# EAGLE design SWD-ud-a-01 (EAGLE 9.5.0)
Assembly variants: 20161007, 20161128
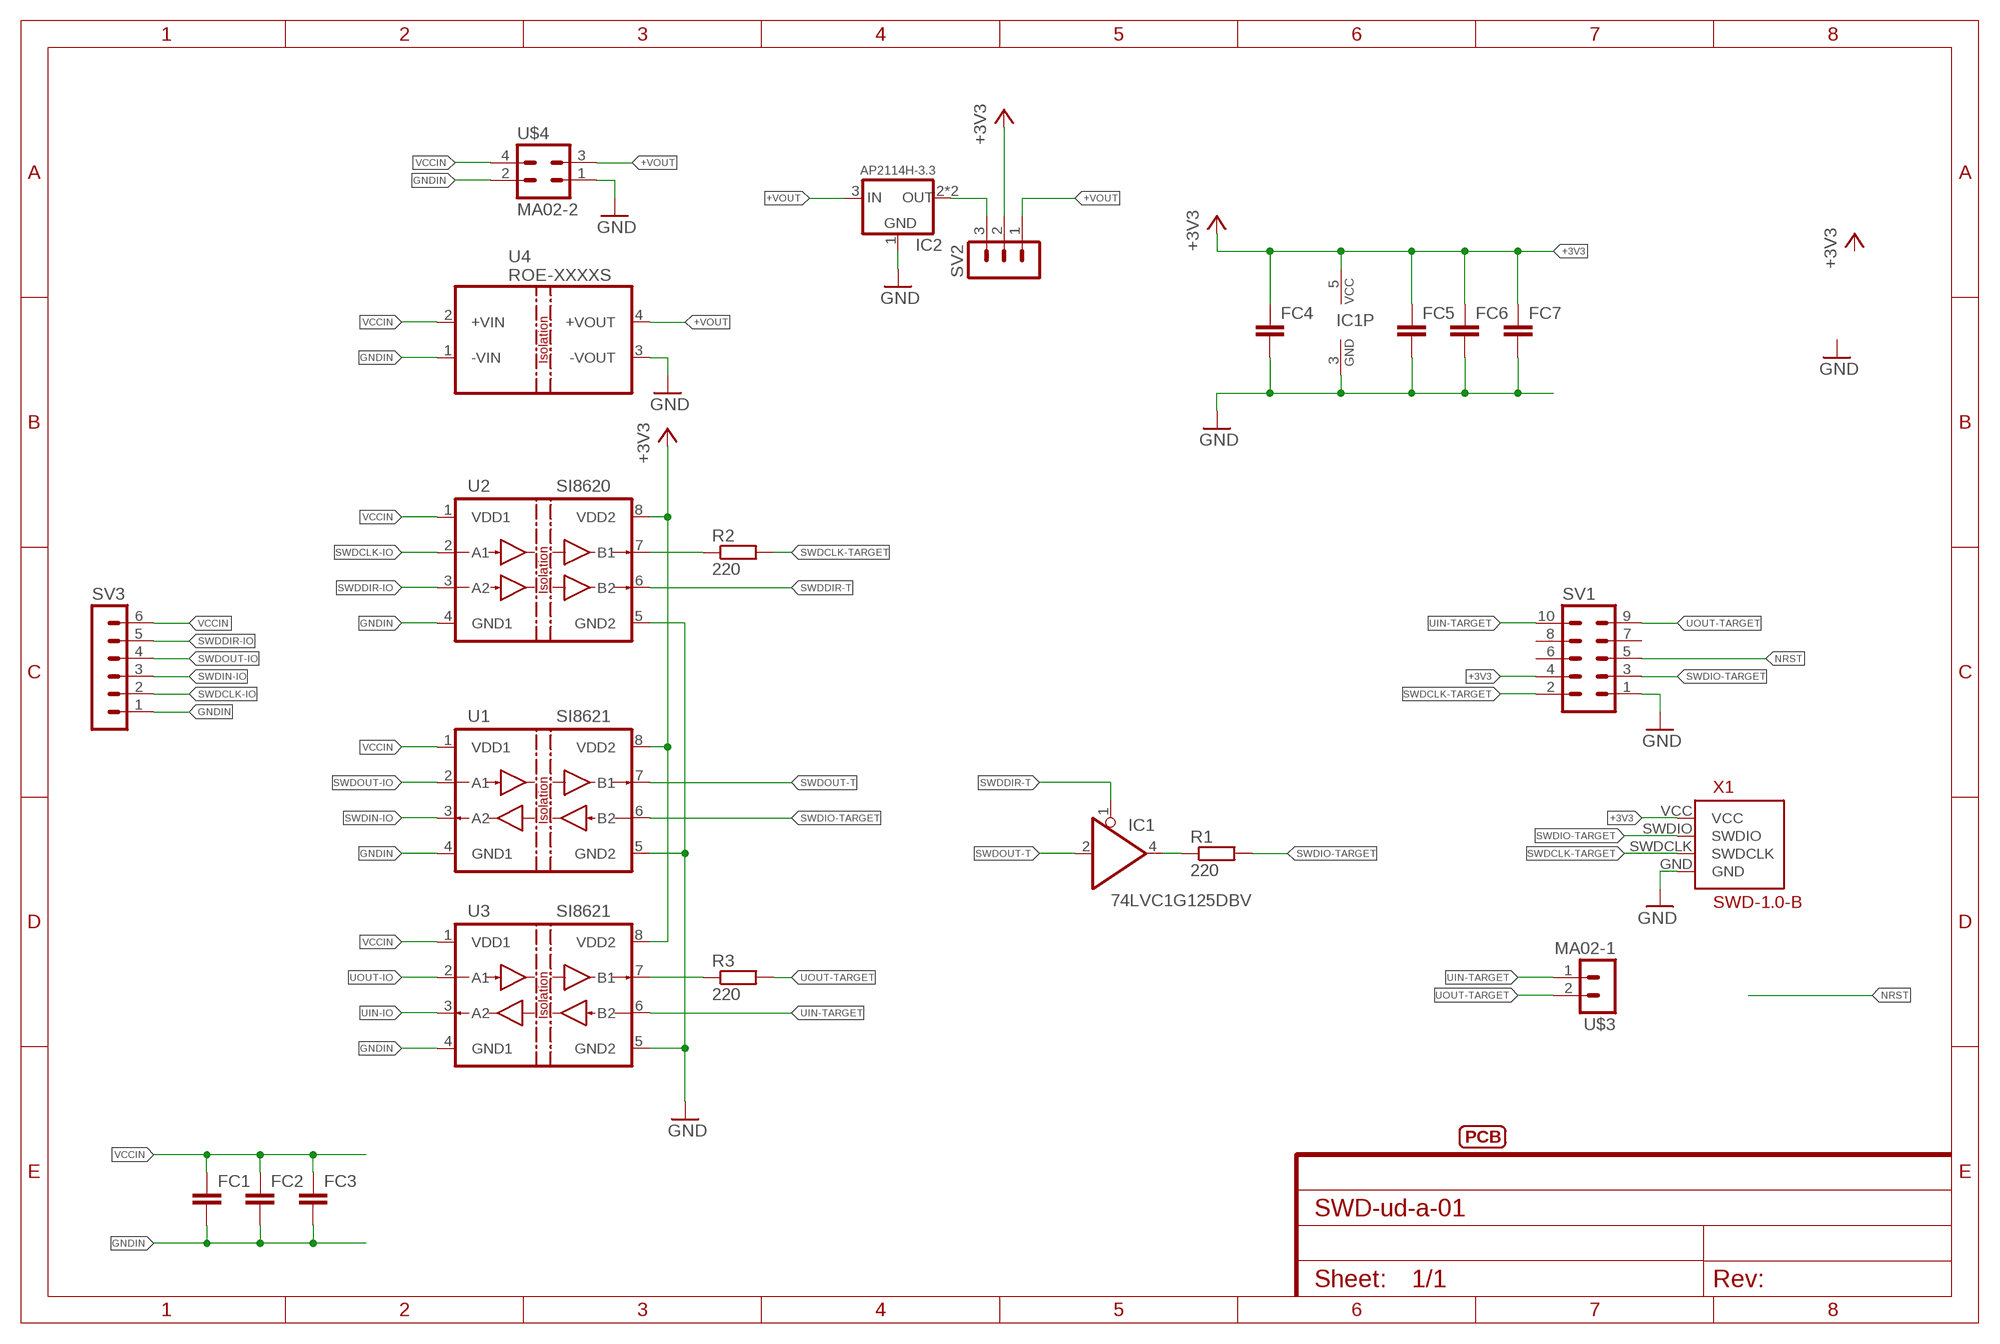
[diagram p0: schematic, sheet 1]

## Parts
FC1  C-EUC0805  [C0805]
FC2  C-EUC0805  [C0805]
FC3  C-EUC0805  [C0805]
FC4  C-EUC0805  [C0805]
FC5  C-EUC0805  [C0805]
FC6  C-EUC0805  [C0805]
FC7  C-EUC0805  [C0805]
IC1  74LVC1G125DBV  [SOT23-5]
IC2  AP2114H-3.3  AP2114H  [SOT223]
R1  220  R-EU_R0603  [R0603]
R2  220  R-EU_R0603  [R0603]
R3  220  R-EU_R0603  [R0603]
SV1  MA05-2  [MA05-2]
SV2  MA03-1  [MA03-1]
SV3  MA06-1  [MA06-1]
U1  SI8621  SI8421  [SOIC-8]
U2  SI8620  [SOIC-8]
U3  SI8621  SI8421  [SOIC-8]
U4  ROE-XXXXS  [ROE-SIP-4]
U$2  ENCLOSURE-CN-60X54  [ENCLOSURE-CN-60X54]
U$3  MA02-1  [MA02-1]
U$4  MA02-2  [MA02-2]
X1  SWD-1.0-B  [SWD-1.0-B]

## Nets
+3V3 [power]: FC4.1 FC5.1 FC6.1 FC7.1 IC1.5(VCC) SV1.4 SV2.2 U1.8(VDD2) U2.8(VDD2) U3.8(VDD2) X1.VCC
+VOUT [power]: IC2.3(IN) SV2.1 U4.4(+VOUT) U$4.3
GND [power]: FC4.2 FC5.2 FC6.2 FC7.2 IC1.3(GND) IC2.1(GND) SV1.1 U1.5(GND2) U2.5(GND2) U3.5(GND2) U4.3(-VOUT) U$4.1 X1.GND
GNDIN [power]: FC1.2 FC2.2 FC3.2 SV3.1 U1.4(GND1) U2.4(GND1) U3.4(GND1) U4.1(-VIN) U$4.2
N$1: IC1.4(O) R1.1
N$2: R2.1 U2.7(B1)
N$3: R3.1 U3.7(B1)
N$4 [power]: IC2.2(OUT) IC2.TAB(OUT) SV2.3
NRST: SV1.5
SWDCLK-IO: SV3.2 U2.2(A1)
SWDCLK-TARGET: R2.2 SV1.2 X1.SWDCLK
SWDDIR-IO: SV3.5 U2.3(A2)
SWDDIR-T: IC1.1(OE) U2.6(B2)
SWDIN-IO: SV3.3 U1.3(A2)
SWDIO-TARGET: R1.2 SV1.3 U1.6(B2) X1.SWDIO
SWDOUT-IO: SV3.4 U1.2(A1)
SWDOUT-T: IC1.2(I) U1.7(B1)
UIN-IO: U3.3(A2)
UIN-TARGET: SV1.10 U3.6(B2) U$3.1
UOUT-IO: U3.2(A1)
UOUT-TARGET: R3.2 SV1.9 U$3.2
VCCIN [power]: FC1.1 FC2.1 FC3.1 SV3.6 U1.1(VDD1) U2.1(VDD1) U3.1(VDD1) U4.2(+VIN) U$4.4
Unconnected: SV1.6 SV1.7 SV1.8

## Library data of the parts
FC1-FC7 = rcl:C-EU: CAPACITOR, European symbol; SPICEPREFIX: C
IC1 = 74xx-little-de:74*1G125: Single Bus Buffer Gate with 3-State Output
IC2 = ps-common:AP2114; PARTNO: AP2114H-3.3TRG1DICT-ND
R1-R3 = rcl:R-EU_: RESISTOR, European symbol; SPICEPREFIX: R
SV1 = alo-con-lstb:MA05-2: PIN HEADER
SV2 = alo-con-lstb:MA03-1: PIN HEADER
SV3 = alo-con-lstb:MA06-1: PIN HEADER
U1 U3 = alo:SI8421
U2 = alo:SI8620
U4 = alo:ROE-XXXXS
U$2 = alo:ENCLOSURE
U$3 = alo-con-lstb:MA02-1
U$4 = alo-con-lstb:MA02-2
X1 = alo:SWD

## Net classes
0 default: width 0.254 mm, drill 0.305 mm, clearance 0.152 mm
1 power: width 0.406 mm, drill 0.457 mm, clearance 0.152 mm
2 d-signal: width 0.203 mm, drill 0.152 mm, clearance 0.152 mm
5 digital: width 0.152 mm, drill 0.152 mm, clearance 0.152 mm

## Board
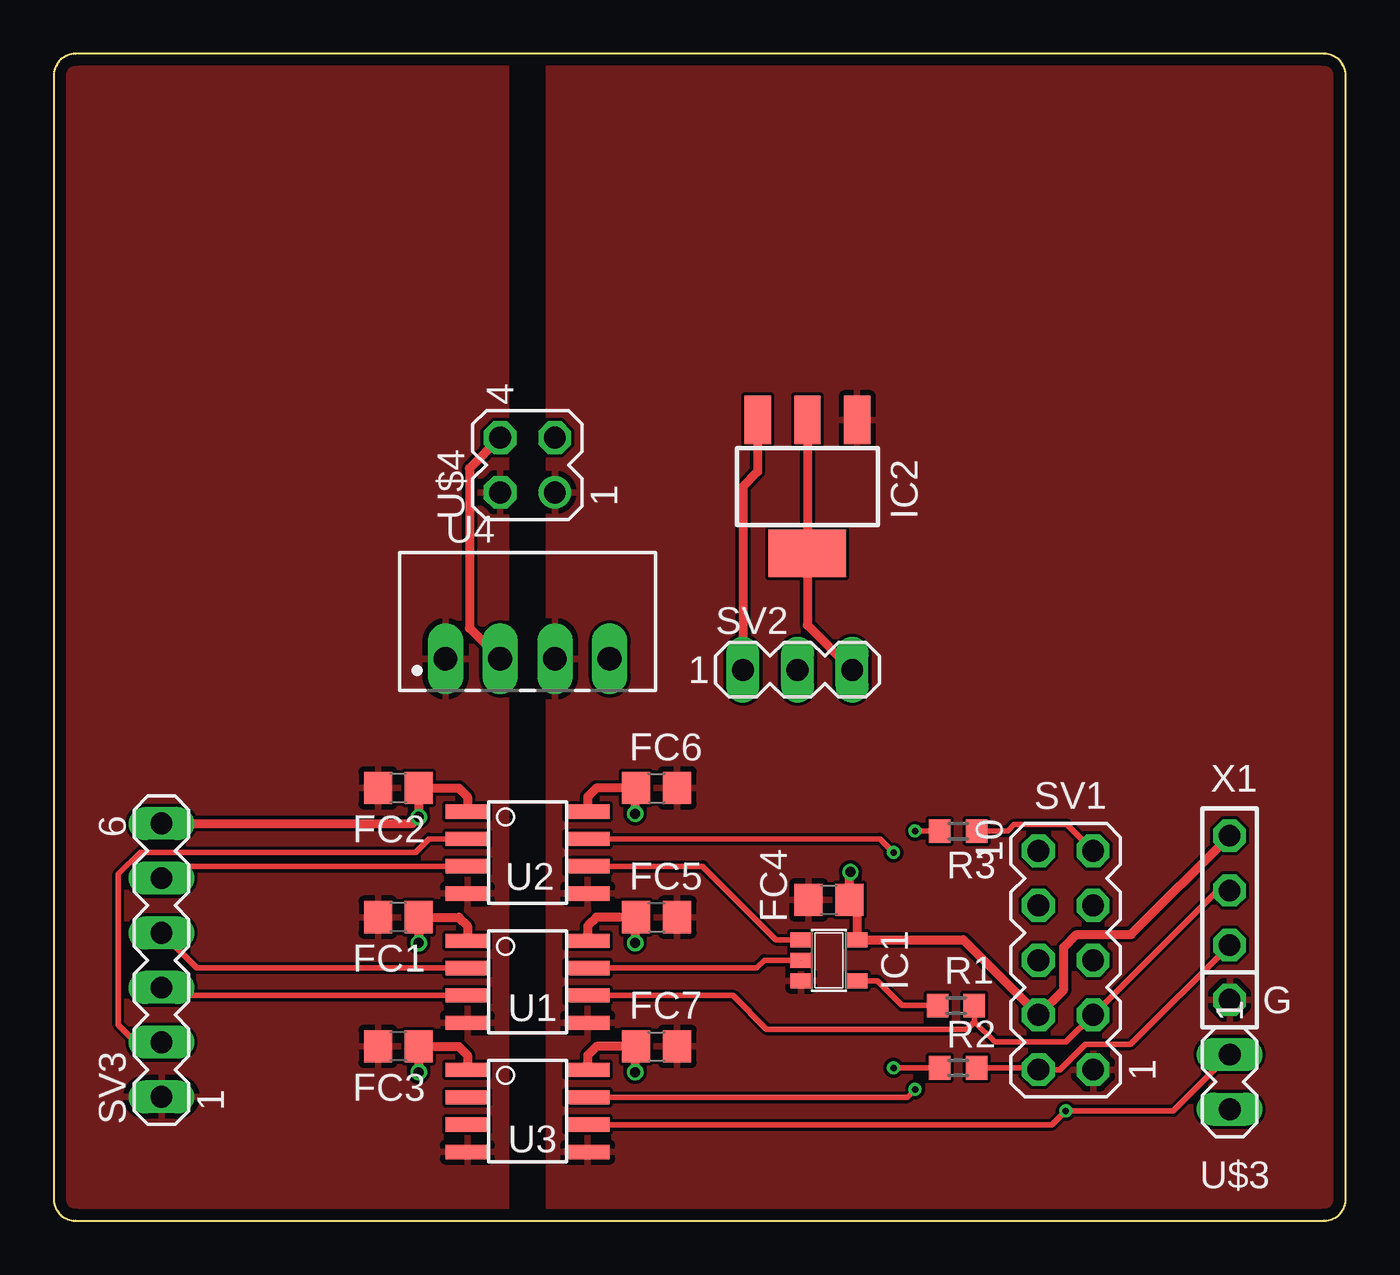
[diagram p1: board, top side]
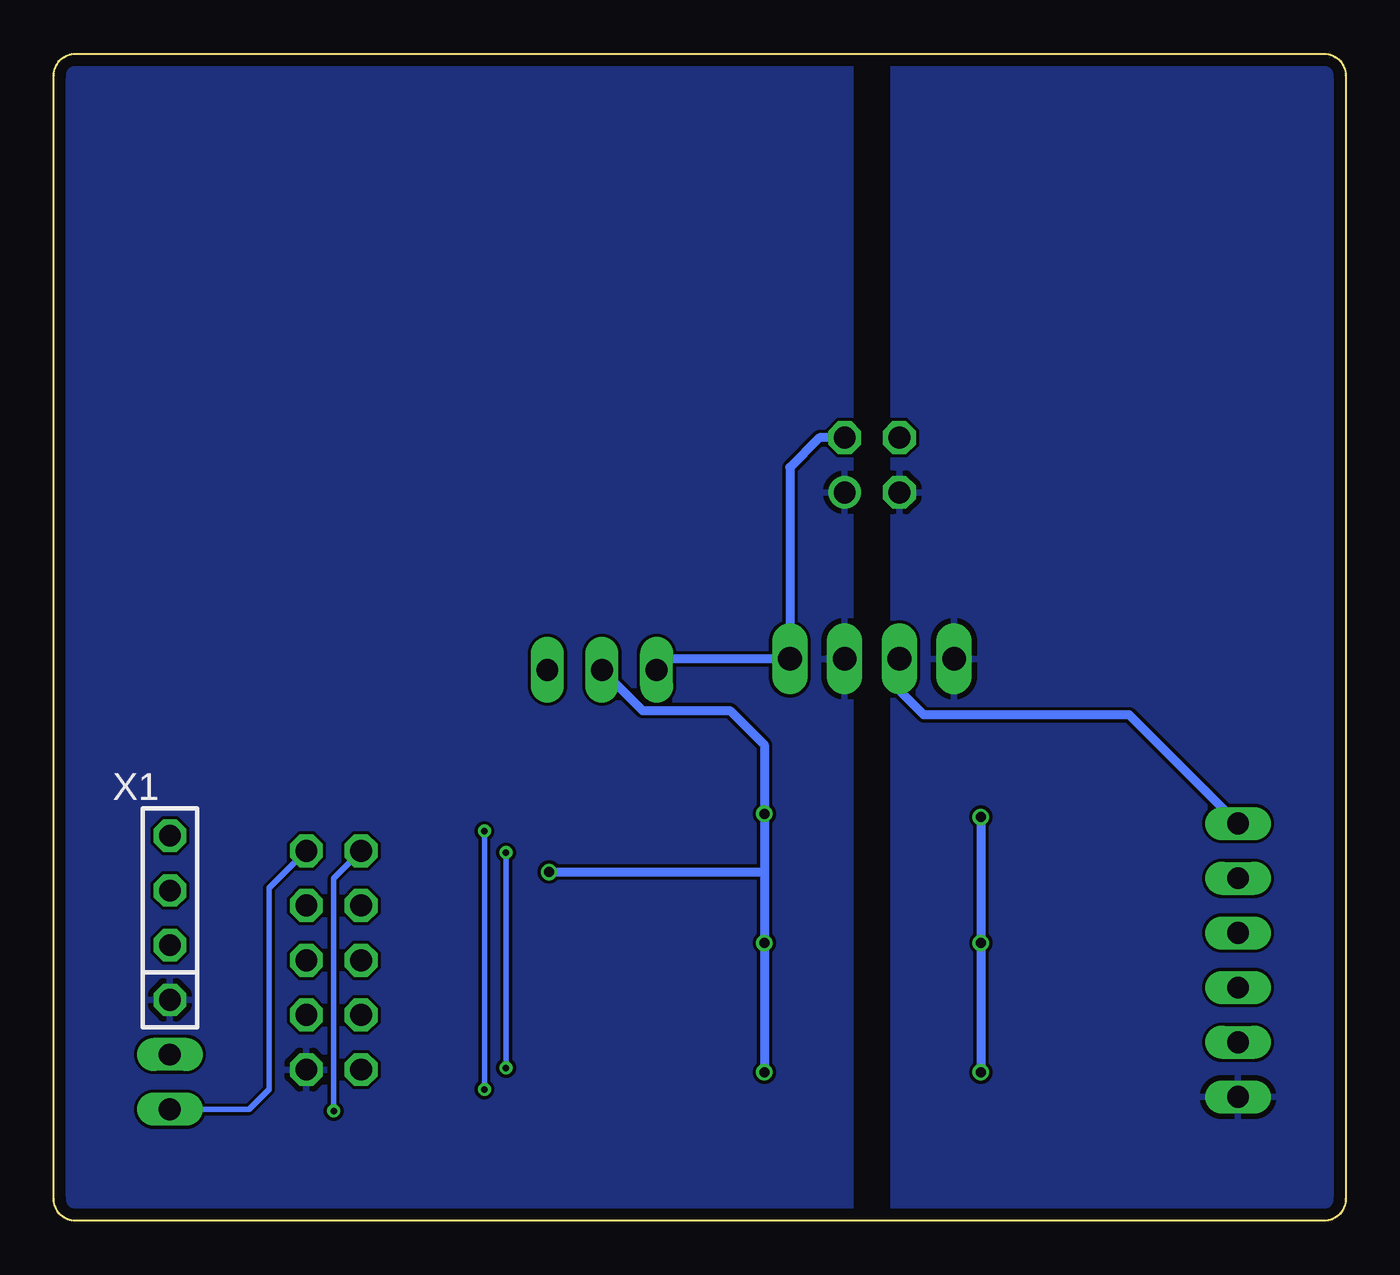
[diagram p2: board, bottom side, seen from below]

Size 60 x 54.2 mm. Coordinates in mm from the lower left corner, seen from the top.
Copper layers (1*16): Top 0.035mm / dielectric 1.6mm / Bottom 0.035mm
Design rules "Elecrow_2-layer_PCB_eagle_rule-2017-09-15 *": minimum track width 6mil, minimum drill 12mil, track to track 6mil, track to pad 6mil, pad to pad 6mil, via to via 8mil, smd to smd 0mil, copper to edge 20mil, drill to drill 10mil, minimum pad ring 6mil, minimum via ring 6mil, stop-mask expansion 0mil, vias tented up to drill 100mil, thermal gap 10mil

### Footprints (pad centres in the part's own frame; a part is rotated, then mirrored left to right if it is on the bottom)
C0805 = smd 1.3 x 1.5: 1 -0.95,0; 2 0.95,0
SOT23-5 = smd 0.69 x 0.99: 1 -0.95,-1.29; 2 0,-1.29; 3 0.95,-1.29; 4 0.95,1.3; 5 -0.95,1.3
SOT223 = smd 1.219 x 2.235: 1 -2.311,-3.099; 2 0,-3.099; 3 2.311,-3.099 | smd 3.6 x 2.2: TAB 0,3.099
R0603 = smd 1 x 1.1: 1 -0.85,0; 2 0.85,0
MA05-2 = drill 1.016 octagon: 1 -5.08,-1.27; 2 -5.08,1.27; 3 -2.54,-1.27; 4 -2.54,1.27; 5 0,-1.27; 6 0,1.27; 7 2.54,-1.27; 8 2.54,1.27; 9 5.08,-1.27; 10 5.08,1.27
MA03-1 = drill 1.016 long: 1 -2.54,0; 2 0,0; 3 2.54,0
MA06-1 = drill 1.016 long: 1 -6.35,0; 2 -3.81,0; 3 -1.27,0; 4 1.27,0; 5 3.81,0; 6 6.35,0
SOIC-8 = smd 0.66 x 2.032: 1 -1.905,-2.794; 2 -0.635,-2.794; 3 0.635,-2.794; 4 1.905,-2.794; 5 1.905,2.794; 6 0.635,2.794; 7 -0.635,2.794; 8 -1.905,2.794
ROE-SIP-4 = drill 1.1 long: 1 -3.81,0; 2 -1.27,0; 3 1.27,0; 4 3.81,0
MA02-1 = drill 1.016 long: 1 -1.27,0; 2 1.27,0
MA02-2 = drill 1.016: 1 -1.27,-1.27 | drill 1.016 octagon: 2 -1.27,1.27; 3 1.27,-1.27; 4 1.27,1.27
SWD-1.0-B = drill 1 octagon: GND 0,-3.81; SWDCLK 0,-1.27; SWDIO 0,1.27; VCC 0,3.81

### Placement (x,y rotation side)
FC1  16,14.1 180 top
FC2  16,20.1 180 top
FC3  16,8.1 180 top
FC4  36,14.9 180 top
FC5  28,14.1 0 top
FC6  28,20.1 0 top
FC7  28,8.1 0 top
IC1  36,12.1 270 top
IC2  35,34.1 180 top
R1  41.9,10 0 top
R2  42,7.1 0 top
R3  42,18.1 0 top
SV1  47,12.1 90 top
SV2  34.54,25.59 0 top
SV3  5,12.1 90 top
U1  22,11.1 270 top
U2  22,17.1 270 top
U3  22,5.1 270 top
U4  22,26.1 0 top
U$2  0,0.1 0 top
U$3  54.61,6.45 270 top
U$4  22,35.1 90 top
X1  54.61,14.07 0 top

### Tracks (layer width: path | path; a pad name or v marks a point on that pad's centre or on a via)
+3V3  (via drill 0.46)
  Top 0.406: U2.8 24.79,19.69 25.2,20.1 FC6.1 27,20.05 v27,18.9 | U1.8 24.79,13.69 25.2,14.1 FC5.1 27,14.05 v27,12.9 | U3.8 24.79,7.69 25.2,8.1 FC7.1 27,8.05 v27,6.9 | v37,16.2 36.95,16.15 FC4.1 37.3,14.55 IC1.5 42.24,13.05 SV1.4 46.9,10.73 46.9,12.7 47.5,13.3 50.03,13.3 X1.VCC
  Bottom 0.406: SV2.2 32.65,23.7 28.6,23.7 27,22.1 v27,18.9 27,16.2 | 27,16.2 v27,12.9 v27,6.9 | v37,16.2 27,16.2
+VOUT
  Top 0.406: IC2.3 32.69,34.79 32,34.1 SV2.1
  Bottom 0.406: SV2.1 31.49,26.1 U4.4 25.81,34.99 24.43,36.37 U$4.3
GND
  pour Bottom: 62,55.1 62,-0.9 23,-0.9 23,55.1
  pour Top: 62,55.1 62,-0.9 23,-0.9 23,55.1
GNDIN
  pour Top: 21,55.1 21,-0.9 -1,-0.9 -1,55.1
  pour Bottom: 21,55.1 21,-0.9 -1,-0.9 -1,55.1
N$1
  Top 0.254: IC1.4 38.25,11.15 39.4,10 R1.1
N$2  (via drill 0.3)
  Top 0.254: U2.7 38.37,17.74 v39,17.1 | v39,7.1 R2.1
  Bottom 0.254: v39,17.1 v39,7.1
N$3  (via drill 0.3)
  Top 0.254: U3.7 39.63,5.73 v40,6.1 | v40,18.1 R3.1
  Bottom 0.254: v40,6.1 v40,18.1
N$4
  Top 0.406: IC2.2 IC2.TAB 35,27.67 SV2.3
SWDCLK-IO
  Top 0.254: SV3.2 3.81,8.29 3,9.1 3,16.1 4,17.1 16.8,17.1 17.43,17.74 U2.2
SWDCLK-TARGET
  Top 0.254: R2.2 45.65,7.1 SV1.2 46.72,7.02 47.9,8.2 50.01,8.2 X1.SWDCLK
SWDDIR-IO
  Top 0.254: SV3.5 5.55,16.46 U2.3
SWDDIR-T
  Top 0.254: U2.6 30.14,16.46 33.55,13.05 IC1.1
SWDIN-IO
  Top 0.254: SV3.3 5.37,10.46 U1.3
SWDIO-TARGET
  Top 0.254: U1.6 31.54,10.46 33.1,8.9 42.4,8.9 42.75,9.25 | 42.75,9.25 R1.2 | 42.75,9.25 43.7,8.3 47.01,8.3 SV1.3 54.05,15.34 X1.SWDIO
SWDOUT-IO
  Top 0.254: SV3.4 6.63,11.73 U1.2
SWDOUT-T
  Top 0.254: U1.7 32.63,11.73 33,12.1 IC1.2
UIN-TARGET  (via drill 0.3)
  Top 0.254: U3.6 46.37,4.46 v47,5.1 51.99,5.1 U$3.1
  Bottom 0.254: v47,5.1 47,15.91 SV1.10
UOUT-TARGET
  Top 0.254: R3.2 44.3,18.1 44.6,18.4 47.05,18.4 SV1.9
  Bottom 0.254: U$3.2 50.92,5.18 50,6.1 50,15.45 SV1.9
VCCIN  (via drill 0.46)
  Top 0.406: U1.1 19.21,13.69 18.8,14.1 FC1.1 v16.95,12.9 | U2.1 19.21,19.69 18.8,20.1 FC2.1 v16.95,18.75 16.65,18.45 SV3.6 | U3.1 19.21,7.69 18.8,8.1 FC3.1 v16.95,6.9 | U$4.4 19.3,34.94 19.3,27.53 U4.2
  Bottom 0.406: v16.95,18.75 v16.95,12.9 v16.95,6.9 | SV3.6 10.05,23.5 19.6,23.5 20.73,24.63 U4.2